# EAGLE design BrunnenwasserSensor (EAGLE 9.6.2)
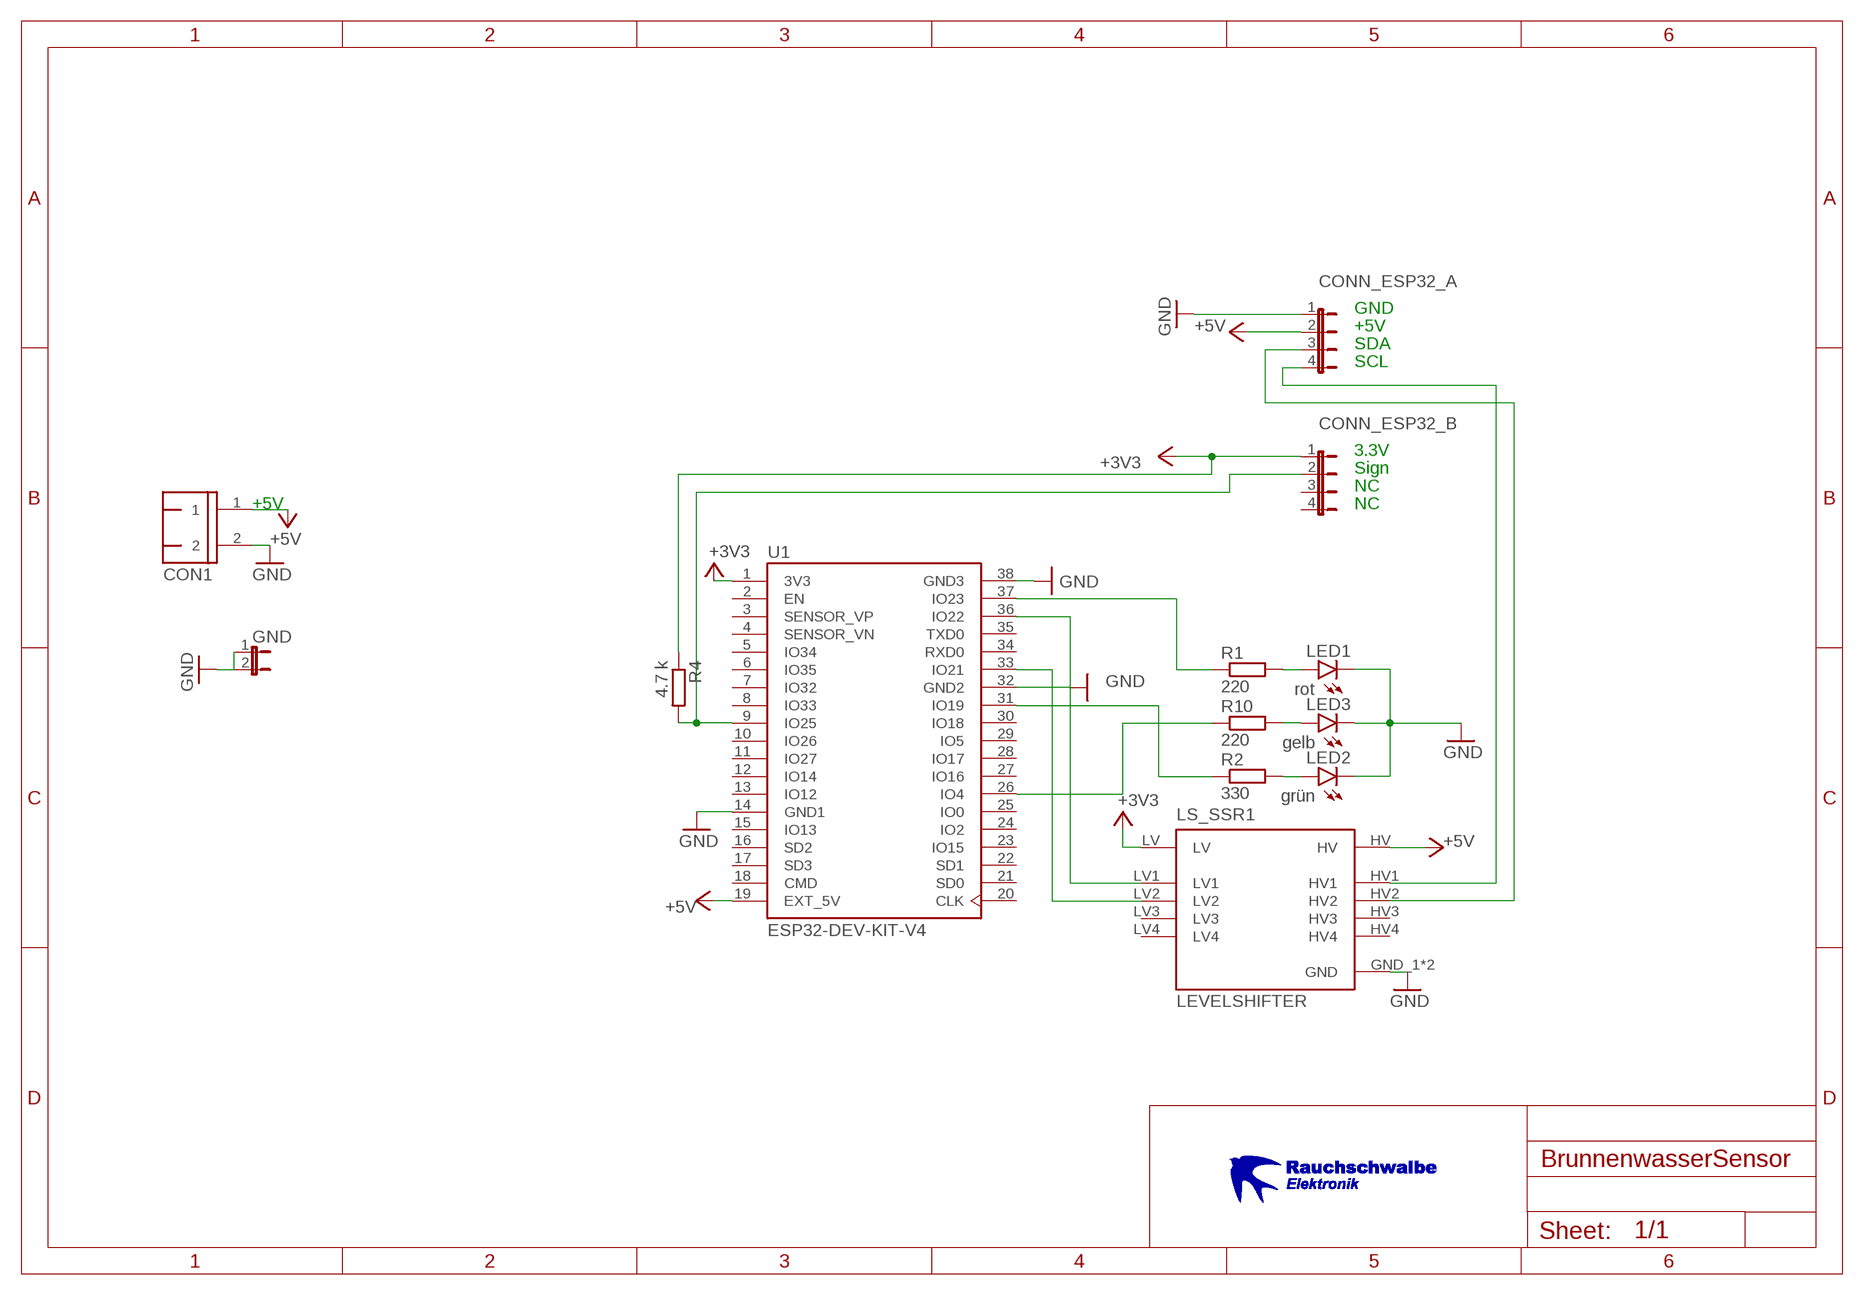
[diagram p0: schematic, sheet 1]

## Parts
CON1  WAGO-500-2  [WAGO-500-2]
CONN_ESP32_A  JP4E  [JP4]
CONN_ESP32_B  JP4E  [JP4]
GND  JP1E  [JP1]
LED1  rot  LED3MM  [LED3MM]
LED2  grün  LED3MM  [LED3MM]
LED3  gelb  LED3MM  [LED3MM]
LS_SSR1  LEVELSHIFTER  [LEVELSHIFTER]
R1  220  R_10MM0207/10  [0207/10]
R2  330  R_10MM0207/10  [0207/10]
R4  4.7 k  R_10MM0207/10  [0207/10]
R10  220  R_10MM0207/10  [0207/10]
U1  ESP32-DEV-KIT-V4  [ESP32-DEV-KIT-V4]
U$1  LOGO_RAUCHSCHWALBE  [LOGO_RAUCHSCHWALBE]

## Nets
+3V3 [Versorgung]: CONN_ESP32_B.1 LS_SSR1.LV R4.1 U1.1(3V3)
+5V [Versorgung]: CON1.1 CONN_ESP32_A.2 LS_SSR1.HV U1.19(EXT_5V)
GND [Versorgung]: CON1.2 CONN_ESP32_A.1 GND.1 GND.2 LED1.K(C) LED2.K(C) LED3.K(C) LS_SSR1.GND_1(GND) LS_SSR1.GND_2(GND) U1.14(GND1) U1.32(GND2) U1.38(GND3)
N$1 [Data]: R1.1 U1.37(IO23)
N$3 [Data]: LED3.A R10.2
N$6 [Data]: R2.1 U1.31(IO19)
N$7 [Data]: LED1.A R1.2
N$8 [Data]: LED2.A R2.2
N$11 [Data]: CONN_ESP32_B.2 R4.2 U1.9(IO25)
N$17 [Data]: R10.1 U1.26(IO4)
SCL: LS_SSR1.LV1 U1.36(IO22)
SCL2: CONN_ESP32_A.4 LS_SSR1.HV1
SDA: LS_SSR1.LV2 U1.33(IO21)
SDA2: CONN_ESP32_A.3 LS_SSR1.HV2
Unconnected: CONN_ESP32_B.3 CONN_ESP32_B.4 LS_SSR1.HV3 LS_SSR1.HV4 LS_SSR1.LV3 LS_SSR1.LV4 U1.2(EN) U1.3(SENSOR_VP) U1.4(SENSOR_VN) U1.5(IO34) U1.6(IO35) U1.7(IO32) U1.8(IO33) U1.10(IO26) U1.11(IO27) U1.12(IO14) U1.13(IO12) U1.15(IO13) U1.16(SD2) U1.17(SD3) U1.18(CMD) U1.20(CLK) U1.21(SD0) U1.22(SD1) U1.23(IO15) U1.24(IO2) U1.25(IO0) U1.27(IO16) U1.28(IO17) U1.29(IO5) U1.30(IO18) U1.34(RXD0) U1.35(TXD0)

## Notes on the sheet
- GND
- +5V
- SDA
- SCL
- 3.3V
- Sign
- NC
- +5V | NC

## Library data of the parts
CON1 = Heizstabsteuerung:WAGO-500-2: WAGO SCREW CLAMP; MPN: 237-102; OC_FARNELL: unknown; OC_NEWARK: 70K9898
CONN_ESP32_A CONN_ESP32_B = jumper:JP4E: JUMPER
GND = jumper:JP1E: JUMPER
LED1-LED3 = Heizstabsteuerung:LED: LED OSRAM: - CHIPLED LG R971, LG N971, LY N971, LG Q971, LY Q971, LO R971, LY R971 LH N974, LH R974 LS Q976, LO Q976, LY Q976 LO Q996 - Hyper CHIPLED LW Q18S LB Q993, LB Q99A, LB R99A - SideLED LS A670, LO A670, LY A670, LG A670, LP A670 LB A673, LV A673, LT A673, LW A673 LH A674 LY A675 LS A676, LA A676, LO A676, LY A676, LW A676 LS A679, LY A679, LG A679 - Hyper Micro SIDELED® LS Y876, LA Y876, LO Y876, LY Y876 LT Y87S - SmartLED LW L88C, LW L88S LB L89C, LB L89S, LG L890 LS L89K, LO L89K, LY L89K LS L896, LA L896, LO L896, LY L896 - TOPLED LS T670, LO T670, LY T670, LG T670, LP T670 LSG T670, LSP T670, LSY T670, LOP T670, LYG T670 LG T671, LOG T671, LSG T671 LB T673, LV T673, LT T673, LW T673 LH T674 LS T676, LA T676, LO T676, LY T676, LB T676, LH T676, LSB T676, LW T676 LB T67C, LV T67C, LT T67C, LS T67K, LO T67K, LY T67K, LW E67C LS E67B, LA E67B, LO E67B, LY E67B, LB E67C, LV E67C, LT E67C LW T67C LS T679, LY T679, LG T679 LS T770, LO T770, LY T770, LG T770, LP T770 LB T773, LV T773, LT T773, LW T773 LH T774 LS E675, LA E675, LY E675, LS T675 LS T776, LA T776, LO T776, LY T776, LB T776 LHGB T686 LT T68C, LB T68C - Hyper Mini TOPLED® LB M676 - Mini TOPLED Santana® LG M470 LS M47K, LO M47K, LY M47K Source: http://www.osram.convergy.de LUXEON: - LUMILED® LXK2-PW12-R00, LXK2-PW12-S00, LXK2-PW14-U00, LXK2-PW14-V00 LXK2-PM12-R00, LXK2-PM12-S00, LXK2-PM14-U00 LXK2-PE12-Q00, LXK2-PE12-R00, LXK2-PE12-S00, LXK2-PE14-T00, LXK2-PE14-U00 LXK2-PB12-K00, LXK2-PB12-L00, LXK2-PB12-M00, LXK2-PB14-N00, LXK2-PB14-P00, LXK2-PB14-Q00 LXK2-PR12-L00, LXK2-PR12-M00, LXK2-PR14-Q00, LXK2-PR14-R00 LXK2-PD12-Q00, LXK2-PD12-R00, LXK2-PD12-S00 LXK2-PH12-R00, LXK2-PH12-S00 LXK2-PL12-P00, LXK2-PL12-Q00, LXK2-PL12-R00 Source: www.luxeon.com KINGBRIGHT: KA-3528ASYC Source: www.kingbright.com
LS_SSR1 = Heizstabsteuerung:LEVELSHIFTER: Logic Level Converter - Bi-Direc Check availability <https://pricing.snapeda.com/parts/BOB-12009/SparkFun/view-part?ref=eda>; AVAILABILITY: In Stock; DESCRIPTION: BSS138 Logic-Level Translator Interface Evaluation Board; MF: SparkFun; MP: BOB-12009; PACKAGE: None; PRICE: None; PURCHASE-URL: https://pricing.snapeda.com/search?q=BOB-12009&ref=eda
R1 R2 R4 R10 = Heizstabsteuerung:R_10MM: RESISTOR, European symbol; SPICEPREFIX: R
U1 = Heizstabsteuerung:ESP32-DEV-KIT-V4: ESP32-DEVKITC Check availability <https://pricing.snapeda.com/parts/ESP32-DEVKITC/Espressif%20Systems/view-part?ref=eda>; AVAILABILITY: In Stock; CHECK_PRICES: https://www.snapeda.com/parts/ESP32-DEVKITC/Espressif+Systems/view-part/?ref=eda; DESCRIPTION: ESP32-WROOM-32UE series Transceiver; 802.11 b/g/n (Wi-Fi, WiFi, WLAN), Bluetooth ® Smart Ready 4.x Dual Mode Evaluation Board; MF: Espressif Systems; MP: ESP32-DEVKITC; PACKAGE: None; PRICE: None; SNAPEDA_LINK: https://www.snapeda.com/parts/ESP32-DEVKITC/Espressif+Systems/view-part/?ref=snap
U$1 = Heizstabsteuerung:LOGO_RAUCHSCHWALBE

## Net classes
1 Versorgung: width 0.762 mm, drill 0.8 mm, clearance 0.508 mm
2 Data: width 0.406 mm, drill 0.6 mm, clearance 0.254 mm

## Board
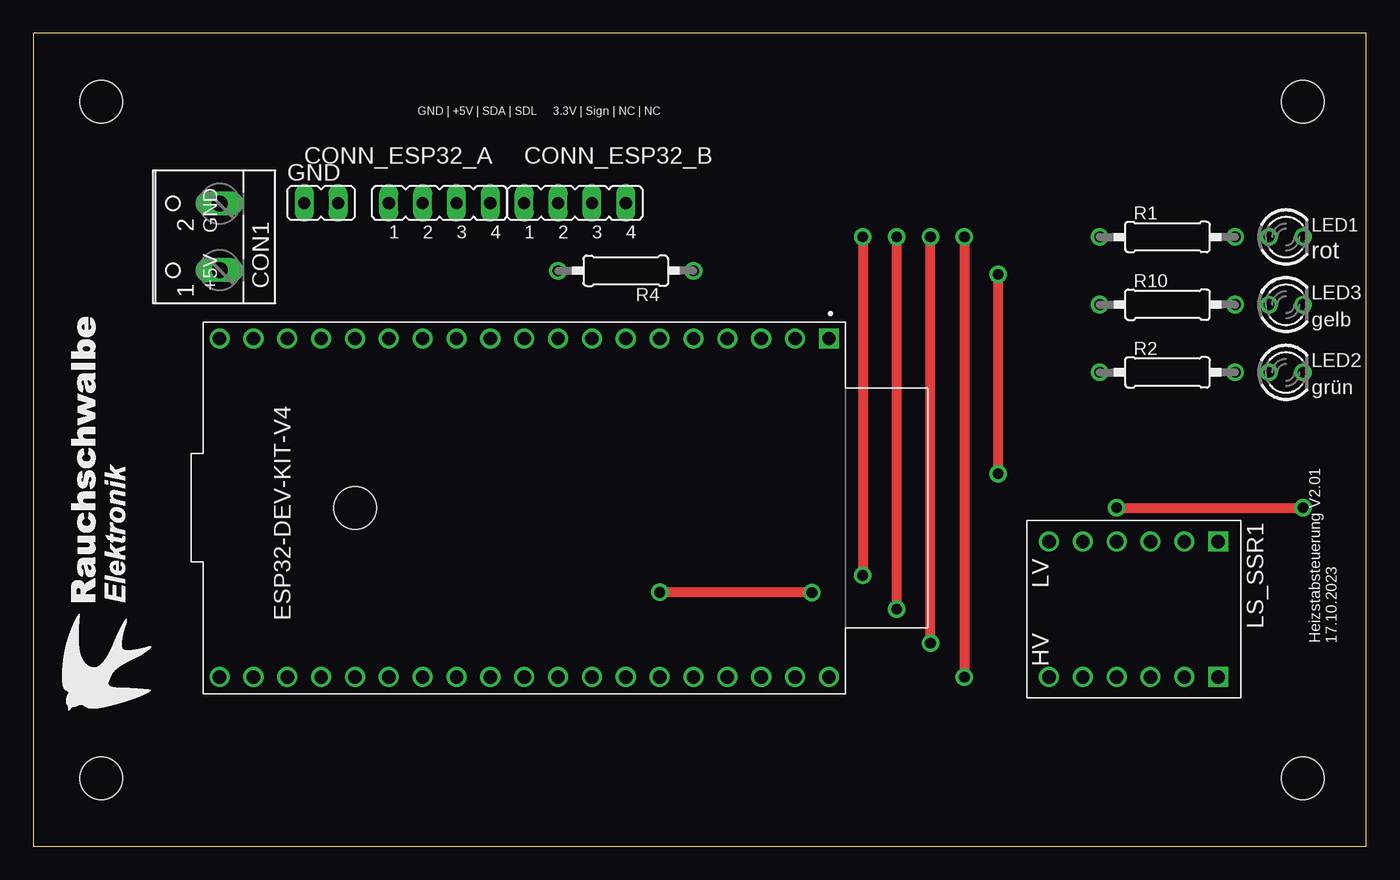
[diagram p1: board, top side]
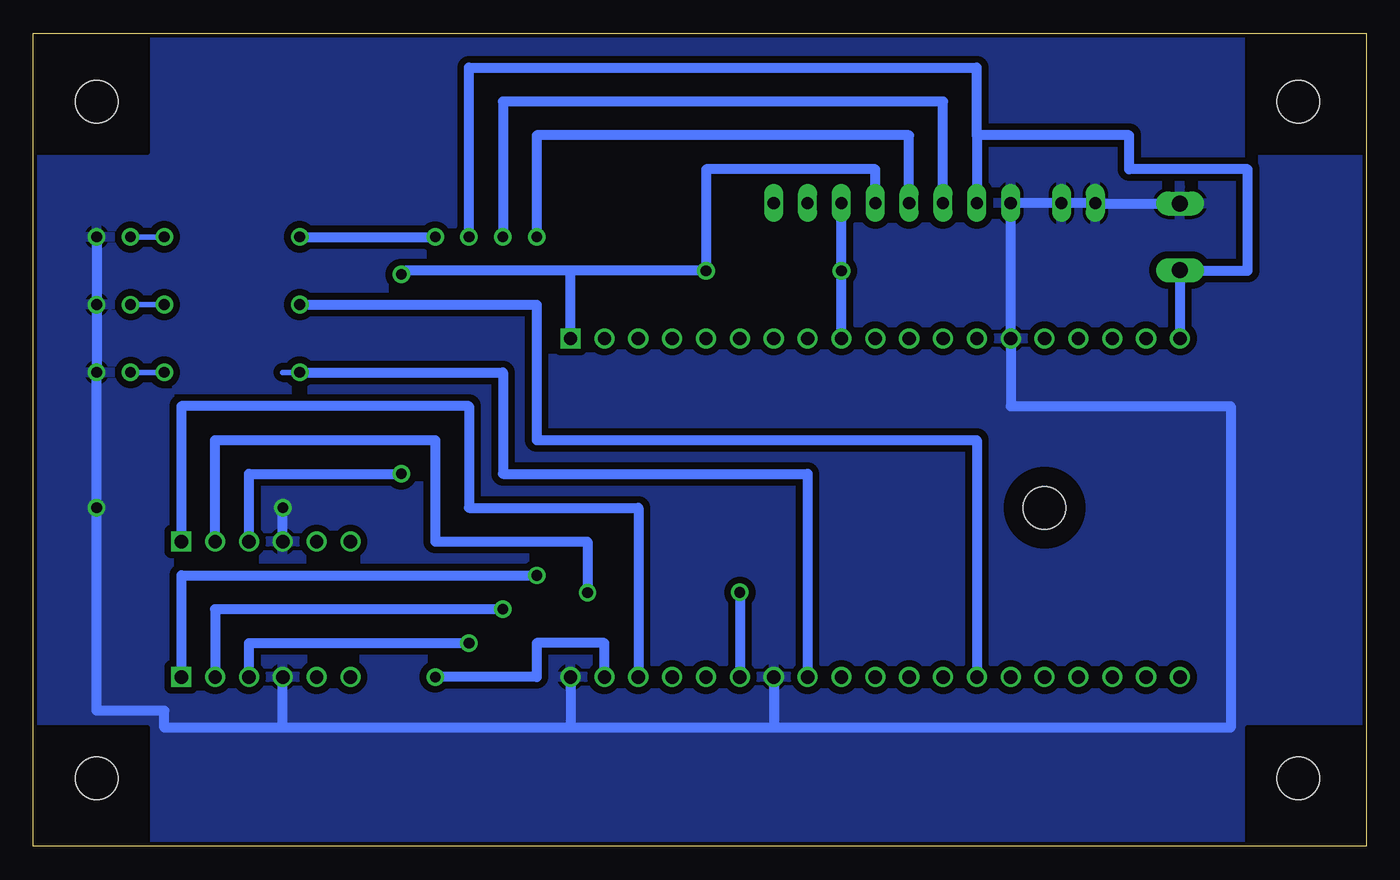
[diagram p2: board, bottom side, seen from below]

Size 100 x 61 mm. Coordinates in mm from the lower left corner, seen from the top.
Outline: 0,0 100,0 100,61 0,61 0,0
Copper layers (1*16): Top 0.035mm / dielectric 1.5mm / Bottom 0.035mm
Design rules "JLCPCB_DRC": minimum track width 5mil, minimum drill 0.3mm, track to track 5mil, track to pad 0.2mm, pad to pad 10mil, via to via 0.5mm, smd to smd 10mil, copper to edge 0.3mm, drill to drill 10mil, minimum pad ring 10mil, minimum via ring 10mil, stop-mask expansion 4mil, vias tented up to drill 0mil, thermal gap 10mil
Holes 3.2 mm at 5.08,55.88 95.25,55.88 95.25,5.08 5.08,5.08 24.13,25.4
bRestrict: area 21.3,22.6 to 27,28.2; 8 lines

### Footprints (pad centres in the part's own frame; a part is rotated, then mirrored left to right if it is on the bottom)
WAGO-500-2 = drill 1.2 long: 1 -2.5,-1.27; 2 2.5,-1.27
JP4 = drill 0.914 long: 1 -3.81,0; 2 -1.27,0; 3 1.27,0; 4 3.81,0
JP1 = drill 0.914 long: 1 0,-1.27; 2 0,1.27
LED3MM = drill 0.8: A -1.27,0; K 1.27,0
LEVELSHIFTER = drill 1: GND_1 5.08,-1.27; GND_2 -5.08,-1.27; HV 5.08,1.27; HV2 5.08,3.81; HV3 5.08,-3.81; HV4 5.08,-6.35; LV -5.08,1.27; LV2 -5.08,3.81; LV3 -5.08,-3.81; LV4 -5.08,-6.35 | drill 1 square: HV1 5.08,6.35; LV1 -5.08,6.35
0207/10 = drill 0.813: 1 -5.08,0; 2 5.08,0
ESP32-DEV-KIT-V4 = drill 1 square: 1 -12.7,22.86 | drill 1: 2 -12.7,20.32; 3 -12.7,17.78; 4 -12.7,15.24; 5 -12.7,12.7; 6 -12.7,10.16; 7 -12.7,7.62; 8 -12.7,5.08; 9 -12.7,2.54; 10 -12.7,0; 11 -12.7,-2.54; 12 -12.7,-5.08; 13 -12.7,-7.62; 14 -12.7,-10.16; 15 -12.7,-12.7; 16 -12.7,-15.24; 17 -12.7,-17.78; 18 -12.7,-20.32; 19 -12.7,-22.86; 20 12.7,-22.86; 21 12.7,-20.32; 22 12.7,-17.78; 23 12.7,-15.24; 24 12.7,-12.7; 25 12.7,-10.16; 26 12.7,-7.62; 27 12.7,-5.08; 28 12.7,-2.54; 29 12.7,0; 30 12.7,2.54; 31 12.7,5.08; 32 12.7,7.62; 33 12.7,10.16; 34 12.7,12.7; 35 12.7,15.24; 36 12.7,17.78; 37 12.7,20.32; 38 12.7,22.86

### Placement (x,y rotation side)
CON1  12.7,45.72 90 top
CONN_ESP32_A  30.48,48.26 0 top
CONN_ESP32_B  40.64,48.26 0 top
GND  21.59,48.26 270 top
LED1  93.98,45.72 0 top
LED2  93.98,35.56 0 top
LED3  93.98,40.64 0 top
LS_SSR1  82.55,17.78 270 top
R1  85.09,45.72 0 top
R2  85.09,35.56 0 top
R4  44.45,43.18 180 top
R10  85.09,40.64 0 top
U1  36.83,25.4 270 top
U$1  8.89,10.16 90 top

### Tracks (layer width: path | path; a pad name or v marks a point on that pad's centre or on a via)
+3V3  (via drill 0.8)
  Top 0.762: v72.39,27.94 v72.39,42.91 72.39,40.64
  Bottom 0.762: CONN_ESP32_B.1 36.83,50.8 49.53,50.8 R4.1 59.69,43.18 | LS_SSR1.LV 83.82,27.94 v72.39,27.94 | 59.69,43.18 72.12,43.18 v72.39,42.91 | U1.1 59.69,43.18
+5V  (via drill 0.8)
  Top 0.762: v67.31,15.24 v67.31,45.72
  Bottom 0.762: U1.19 CON1.1 13.93,43.18 8.89,43.18 8.89,50.8 17.78,50.8 17.78,53.34 29.21,53.34 | 29.21,53.34 CONN_ESP32_A.2 | 29.21,53.34 29.21,58.42 67.31,58.42 v67.31,45.72 | LS_SSR1.HV 83.82,15.24 v67.31,15.24
GND  (via drill 0.8)
  Top 0.762: v81.28,25.4 v95.25,25.4
  Bottom 0.762: CONN_ESP32_A.1 U1.14 26.67,33.02 10.16,33.02 10.16,8.89 44.45,8.89 | CONN_ESP32_A.1 26.63,48.22 | LED1.K LED3.K LED2.K v95.25,25.4 95.25,10.16 90.17,10.16 90.17,8.89 81.28,8.89 | U1.32 44.45,8.89 | 44.45,8.89 59.69,8.89 | U1.38 59.69,8.89 | 59.69,8.89 81.28,8.89 | 81.28,8.89 LS_SSR1.GND_1 | LS_SSR1.GND_2 v81.28,25.4 | CONN_ESP32_A.1 GND.2 GND.1 20.28,48.22 CON1.2
  pour Bottom: -1.27,63.5 102.87,63.5 102.87,-2.54 -1.27,-2.54
N$1  (via drill 0.8)
  Top 0.762: v69.85,45.72 v69.85,12.7
  Bottom 0.762: R1.1 v69.85,45.72 | U1.37 57.15,15.24 62.23,15.24 62.23,12.7 v69.85,12.7
N$3
  Bottom 0.406: LED3.A R10.2
N$6
  Bottom 0.406: 81.28,35.56 R2.1
  Bottom 0.762: R2.1 64.77,35.56 64.77,27.94 41.91,27.94 U1.31
N$7
  Bottom 0.406: LED1.A R1.2
N$8
  Bottom 0.406: LED2.A R2.2
N$11
  Bottom 0.762: U1.9 R4.2 CONN_ESP32_B.2
N$17
  Bottom 0.762: U1.26 29.21,30.48 62.23,30.48 62.23,40.64 R10.1
SCL
  Bottom 0.762: U1.36 54.61,25.4 67.31,25.4 67.31,33.02 88.9,33.02 LS_SSR1.LV1
SCL2  (via drill 0.8)
  Top 0.762: v62.23,45.72 v62.23,20.32
  Bottom 0.762: CONN_ESP32_A.4 34.29,53.34 62.23,53.34 v62.23,45.72 | v62.23,20.32 88.9,20.32 LS_SSR1.HV1
SDA  (via drill 0.8)
  Top 0.762: v58.42,19.03 58.4,19.05 v46.99,19.05
  Bottom 0.762: LS_SSR1.LV2 86.36,30.48 69.85,30.48 69.85,22.86 58.42,22.86 v58.42,19.03 | v46.99,19.05 U1.33
SDA2  (via drill 0.8)
  Top 0.762: v64.77,45.72 v64.77,17.78
  Bottom 0.762: CONN_ESP32_A.3 31.75,55.88 64.77,55.88 v64.77,45.72 | v64.77,17.78 86.36,17.78 LS_SSR1.HV2

### Text on the board
tNames: GND | +5V | SDA | SDL | 3.3V | Sign | NC | NC | GND | +5V | Heizstabsteuerung V2.01 / 17.10.2023